# EAGLE design E-Slushy (EAGLE 6.6.0)
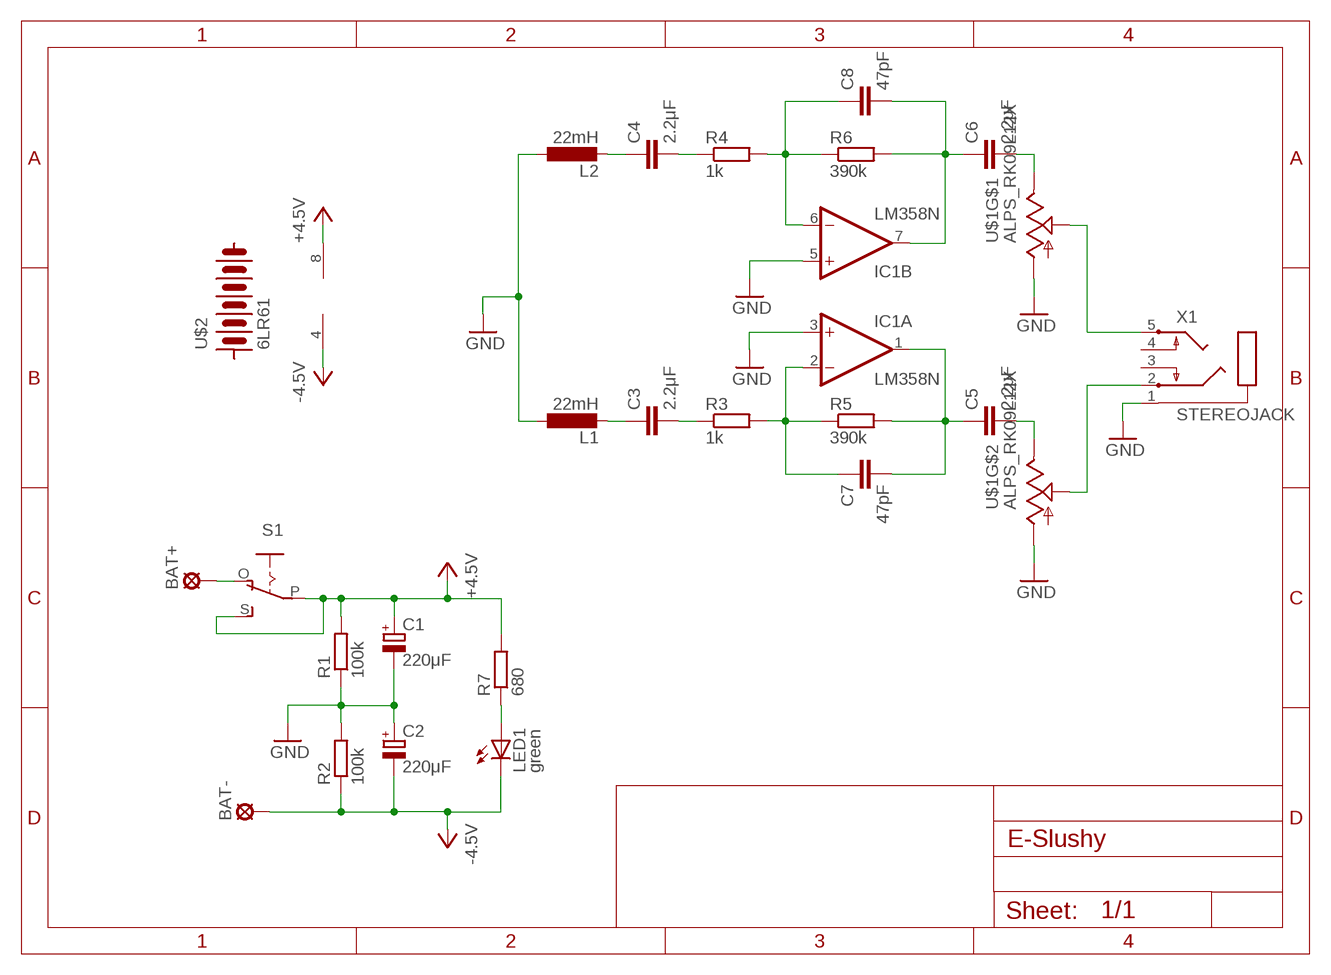
[diagram p0: schematic, sheet 1]

## Parts
BAT+  SE14  [SE14]
BAT-  SE14  [SE14]
C1  220μF  CPOL-EUD  [PANASONIC_D]
C2  220μF  CPOL-EUD  [PANASONIC_D]
C3  2.2μF  C-EUC1206K  [C1206K]
C4  2.2μF  C-EUC1206K  [C1206K]
C5  2.2μF  C-EUC1206K  [C1206K]
C6  2.2μF  C-EUC1206K  [C1206K]
C7  47pF  C-EUC1206K  [C1206K]
C8  47pF  C-EUC1206K  [C1206K]
IC1  LM358N  [DIL08]
L1  22mH  L-EU6000-XXX-RC  [6000-XXXX-RC]
L2  22mH  L-EU6000-XXX-RC  [6000-XXXX-RC]
LED1  green  LED5MM  [LED5MM]
R1  100k  R-EU_R1206  [R1206]
R2  100k  R-EU_R1206  [R1206]
R3  1k  R-EU_R1206  [R1206]
R4  1k  R-EU_R1206  [R1206]
R5  390k  R-EU_R1206  [R1206]
R6  390k  R-EU_R1206  [R1206]
R7  680  R-EU_R1206  [R1206]
S1  EG1218S  [EG1218]
U$1  ALPS_RK09L12X  [RK09L12]
U$2  6LR61  [6LR61]
X1  STEREOJACK  [STX3100]

## Nets
+4.5V: C1.+ IC1.8(P:V+) R1.2 R7.2 S1.P S1.S
-4.5V: BAT-.MP C2.- IC1.4(P:V-) LED1.K(C) R2.1
GND: C1.- C2.+ IC1.3(A:+IN) IC1.5(B:+IN) L1.1 L2.1 R1.1 R2.2 U$1.A1 U$1.B1 X1.1
N$1: C3.1 L1.2
N$2: C3.2 R3.1
N$3: C4.1 L2.2
N$4: C4.2 R4.1
N$5: C7.1 IC1.2(A:-IN) R3.2 R5.1
N$6: C5.1 C7.2 IC1.1(A:OUT) R5.2
N$7: C8.1 IC1.6(B:-IN) R4.2 R6.1
N$8: C6.1 C8.2 IC1.7(B:OUT) R6.2
N$9: C5.2 U$1.B3
N$10: C6.2 U$1.A3
N$11: U$1.B2 X1.2
N$12: U$1.A2 X1.5
N$13: BAT+.MP S1.O
N$14: LED1.A R7.1
Unconnected: X1.3 X1.4

## Library data of the parts
BAT+ BAT- = solpad:SE14: SOLDER PAD E1553, drill 1,4mm, distributor Buerklin, 07F820
C1 C2 = rcl:CPOL-EU: POLARIZED CAPACITOR, European symbol
C3-C8 = rcl:C-EU: CAPACITOR, European symbol
IC1 = linear:LM358: OP AMP also LM158; LM258; LM2904 Source: http://cache.national.com/ds/LM/LM158.pdf
L1 L2 = rcl:L-EU: INDUCTOR, European symbol
LED1 = led:LED: LED OSRAM: - CHIPLED LG R971, LG N971, LY N971, LG Q971, LY Q971, LO R971, LY R971 LH N974, LH R974 LS Q976, LO Q976, LY Q976 LO Q996 - Hyper CHIPLED LW Q18S LB Q993, LB Q99A, LB R99A - SideLED LS A670, LO A670, LY A670, LG A670, LP A670 LB A673, LV A673, LT A673, LW A673 LH A674 LY A675 LS A676, LA A676, LO A676, LY A676, LW A676 LS A679, LY A679, LG A679 - Hyper Micro SIDELED® LS Y876, LA Y876, LO Y876, LY Y876 LT Y87S - SmartLED LW L88C, LW L88S LB L89C, LB L89S, LG L890 LS L89K, LO L89K, LY L89K LS L896, LA L896, LO L896, LY L896 - TOPLED LS T670, LO T670, LY T670, LG T670, LP T670 LSG T670, LSP T670, LSY T670, LOP T670, LYG T670 LG T671, LOG T671, LSG T671 LB T673, LV T673, LT T673, LW T673 LH T674 LS T676, LA T676, LO T676, LY T676, LB T676, LH T676, LSB T676, LW T676 LB T67C, LV T67C, LT T67C, LS T67K, LO T67K, LY T67K, LW E67C LS E67B, LA E67B, LO E67B, LY E67B, LB E67C, LV E67C, LT E67C LW T67C LS T679, LY T679, LG T679 LS T770, LO T770, LY T770, LG T770, LP T770 LB T773, LV T773, LT T773, LW T773 LH T774 LS E675, LA E675, LY E675, LS T675 LS T776, LA T776, LO T776, LY T776, LB T776 LHGB T686 LT T68C, LB T68C - Hyper Mini TOPLED® LB M676 - Mini TOPLED Santana® LG M470 LS M47K, LO M47K, LY M47K Source: http://www.osram.convergy.de LUXEON: - LUMILED® LXK2-PW12-R00, LXK2-PW12-S00, LXK2-PW14-U00, LXK2-PW14-V00 LXK2-PM12-R00, LXK2-PM12-S00, LXK2-PM14-U00 LXK2-PE12-Q00, LXK2-PE12-R00, LXK2-PE12-S00, LXK2-PE14-T00, LXK2-PE14-U00 LXK2-PB12-K00, LXK2-PB12-L00, LXK2-PB12-M00, LXK2-PB14-N00, LXK2-PB14-P00, LXK2-PB14-Q00 LXK2-PR12-L00, LXK2-PR12-M00, LXK2-PR14-Q00, LXK2-PR14-R00 LXK2-PD12-Q00, LXK2-PD12-R00, LXK2-PD12-S00 LXK2-PH12-R00, LXK2-PH12-S00 LXK2-PL12-P00, LXK2-PL12-Q00, LXK2-PL12-R00 Source: www.luxeon.com KINGBRIGHT: KA-3528ASYC Source: www.kingbright.com
R1-R7 = rcl:R-EU_: RESISTOR, European symbol
S1 = adafruit:EG1218: SLIDING SWITCH 0.1" spacing through hole, vertical SPDT slide switch http://www.ladyada.net/library/pcb/eaglelibrary.html
U$1 = audio-pots:ALPS_RK09L12X
U$2 = battery:6LR61
X1 = adafruit:STEREOJACK: MIC/HEADPHONE JACK Stereo jack with two switches. Kycon STX3100, CUI SJ1-3555NG and/or 4UCon 05544

## Board
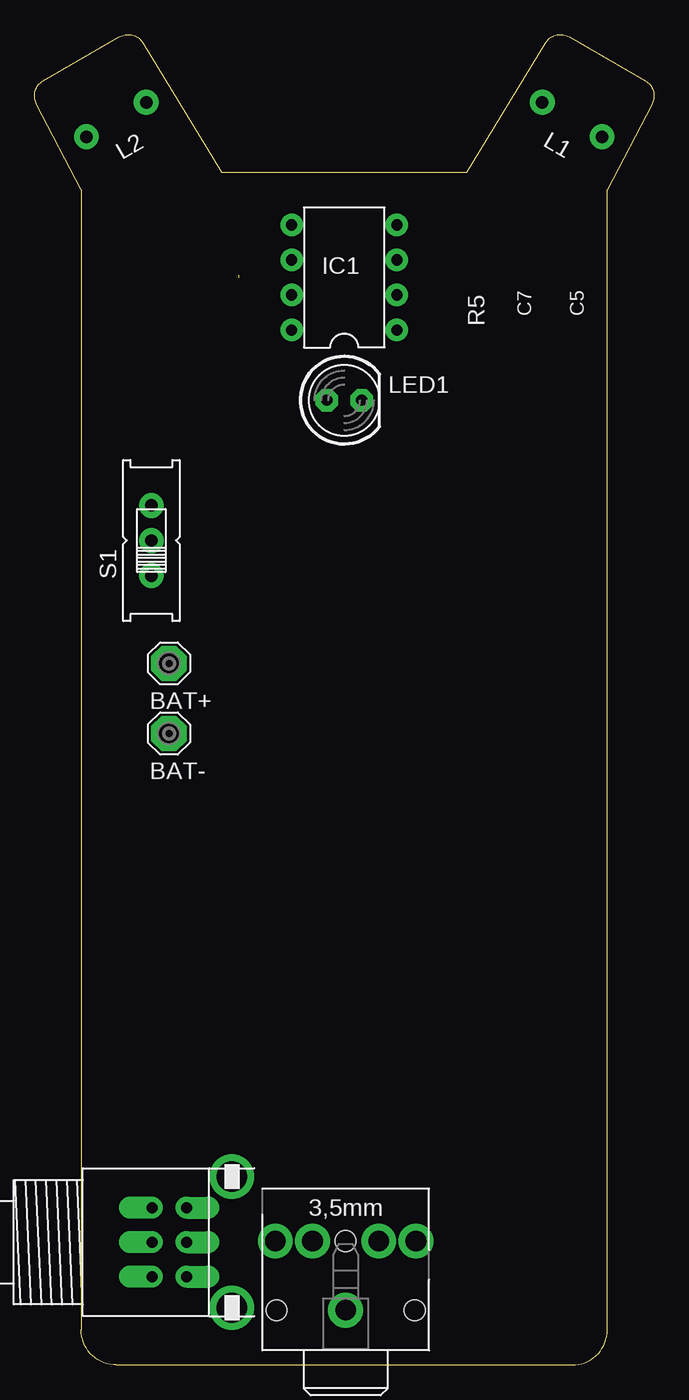
[diagram p1: board, top side]
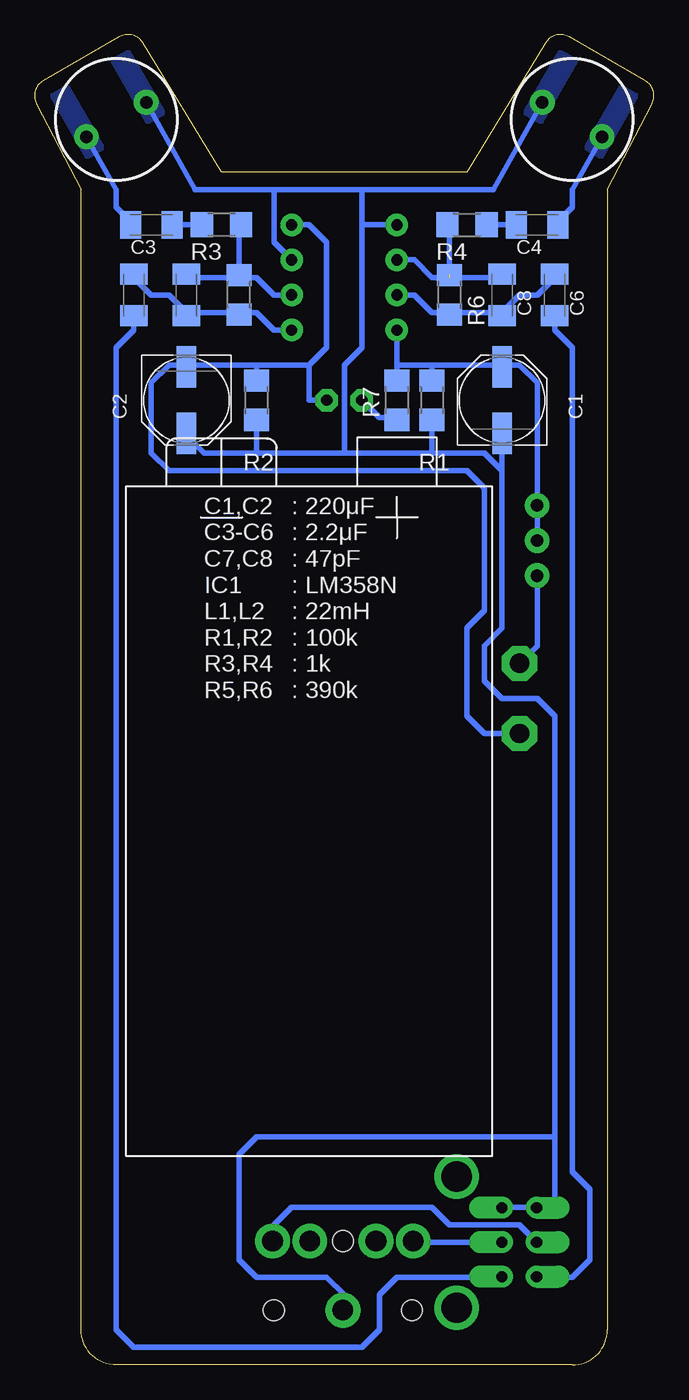
[diagram p2: board, bottom side, seen from below]

Size 44.87 x 96.33 mm. Coordinates in mm from the lower left corner, seen from the top.
Outline: 5.92,0 arc-90 3.38,2.54 3.38,85.09 0.17,91.25 arc-90 0.63,92.98 6.13,96.16 arc-90 7.87,95.69 13.54,86.36 31.32,86.36 37,95.69 arc-90 38.73,96.16 44.23,92.98 arc-90 44.7,91.25 41.48,85.09 41.48,2.54 arc-90 38.94,0 5.92,0
Copper layers (1*16): Top 0.035mm / dielectric 1.5mm / Bottom 0.035mm
Design rules "SeeedStudio_2layer_DRU_no_angle_20140221 *": minimum track width 6mil, minimum drill 12mil, track to track 6mil, track to pad 6mil, pad to pad 6mil, via to via 6mil, smd to smd 0mil, copper to edge 10mil, drill to drill 10mil, minimum pad ring 10mil, minimum via ring 6mil, stop-mask expansion 2mil, vias tented up to drill 100mil, thermal gap 10mil

### Footprints (pad centres in the part's own frame; a part is rotated, then mirrored left to right if it is on the bottom)
SE14 = drill 1.397 pad 2.54 octagon: MP 0,0
PANASONIC_D = smd 3 x 1.4: + 2.4,0; - -2.4,0
C1206K = smd 1.5 x 2: 1 -1.5,0; 2 1.5,0
DIL08 = drill 0.813 pad 1.27: 1 -3.81,-3.81; 2 -1.27,-3.81; 3 1.27,-3.81; 4 3.81,-3.81; 5 3.81,3.81; 6 1.27,3.81; 7 -1.27,3.81; 8 -3.81,3.81
6000-XXXX-RC = drill 0.9 pad 1.422: 1 -2.5,0; 2 2.5,0
LED5MM = drill 0.813 octagon: A -1.27,0; K 1.27,0
R1206 = smd 1.6 x 1.803: 1 -1.422,0; 2 1.422,0
EG1218 = drill 0.9 pad 1.676: O -2.54,0; P 0,0; S 2.54,0
RK09L12 = drill 0.8 offset: A1 2.5,2.5; A2 0,2.5; A3 -2.5,2.5; B1 2.5,0; B2 0,0; B3 -2.5,0 | drill 2.2 pad 3: P$1 -4.75,-3.3; P$2 4.75,-3.3
STX3100 = drill 1.5 pad 2.54: 1 2.7,-0.1 | drill 1.5: 2 7.7,5; 3 7.7,2.3; 4 7.7,-2.5; 5 7.7,-5.2 | hole 1.5: 2.7,4.9; 2.7,-5.1; 7.7,-0.1

### Placement (x,y rotation side)
BAT+  9.73,50.8 0 top
BAT-  9.73,45.72 0 top
C1  11,69.85 90 bottom
C2  33.86,69.85 270 bottom
C3  36.4,82.55 0 bottom
C4  8.46,82.55 180 bottom
C5  37.67,77.47 270 bottom
C6  7.19,77.47 270 bottom
C7  33.86,77.47 270 bottom
C8  11,77.47 270 bottom
IC1  22.43,78.74 90 top
L1  38.94,90.17 210 bottom
L2  5.92,90.17 330 bottom
LED1  22.43,69.85 0 top
R1  16.08,69.85 90 bottom
R2  28.78,69.85 270 bottom
R3  31.32,82.55 0 bottom
R4  13.54,82.55 180 bottom
R5  30.05,77.47 270 bottom
R6  14.81,77.47 270 bottom
R7  18.62,69.85 90 bottom
S1  8.46,59.69 90 top
U$1  11,8.89 90 top
U$2  24.97,39.37 0 bottom
X1  22.43,1.27 90 top

### Tracks (layer width: path | path; a pad name or v marks a point on that pad's centre or on a via)
+4.5V
  Bottom 0.406: R1.2 16.08,72.39 | 16.08,72.39 18.62,72.39 | 18.62,72.39 IC1.8 | 11,72.39 16.08,72.39 | S1.P S1.S 8.46,68.58 8.46,71.12 9.73,72.39 11,72.39 | C1.+ 11,72.39 | R7.2 18.62,72.39
-4.5V
  Bottom 0.406: 24.97,72.39 23.7,73.66 23.7,81.28 24.97,82.55 IC1.4 | BAT-.MP 12.27,45.72 13.54,46.99 13.54,53.34 12.27,54.61 12.27,63.5 13.54,64.77 35.13,64.77 36.4,66.04 36.4,71.12 35.13,72.39 33.86,72.39 | R2.1 28.78,72.39 | 28.78,72.39 24.97,72.39 | 33.86,72.39 28.78,72.39 | C2.- 33.86,72.39 | LED1.K 24.97,69.85 24.97,72.39
GND
  Bottom 0.406: 21.16,85.09 27.51,85.09 | IC1.3 27.51,81.28 27.51,85.09 | 21.16,82.55 21.16,73.66 22.43,72.39 22.43,66.04 | 21.16,82.55 21.16,85.09 | IC1.5 21.16,82.55 | 22.43,66.04 28.78,66.04 | 28.78,66.04 32.59,66.04 33.86,67.31 C2.+ | 16.08,66.04 12.27,66.04 11,64.77 | 16.08,66.04 22.43,66.04 | C1.- 11,64.77 | 11,64.77 11,53.34 12.27,52.07 12.27,49.53 11,48.26 8.46,48.26 7.19,46.99 7.19,16.51 | 7.19,16.51 7.19,11.43 8.46,11.43 | U$1.A1 8.46,11.43 | 8.46,11.43 10.96,11.43 U$1.B1 | X1.1 22.53,3.91 22.43,3.81 22.43,5.08 23.7,6.35 28.78,6.35 30.05,7.62 30.05,15.24 28.78,16.51 7.19,16.51 | L1.1 33.23,85.09 27.51,85.09 | L2.1 11.64,85.09 21.16,85.09 | R1.1 16.08,66.04 | R2.2 28.78,66.04
  pour Bottom (no thermals): 9.31,90.66 8.21,90.02 5.67,94.42 6.77,95.06
  pour Bottom (no thermals): 36.66,90.02 35.56,90.66 38.1,95.06 39.2,94.42
N$1
  Bottom 0.406: L1.2 38.94,85.09 38.94,83.82 37.67,82.55 C3.1
  pour Bottom (no thermals): 41.06,87.48 39.96,88.12 42.5,92.52 43.6,91.88
N$2
  Bottom 0.406: R3.1 C3.2
N$3
  Bottom 0.406: L2.2 5.92,85.09 5.92,83.82 7.19,82.55 C4.1
  pour Bottom (no thermals): 4.91,88.12 3.81,87.48 1.27,91.88 2.37,92.52
N$4
  Bottom 0.406: C4.2 R4.1
N$5
  Bottom 0.406: IC1.2 27.51,77.47 28.78,78.74 30.05,78.74 | 30.05,78.74 R5.1 30.05,82.55 R3.2 | 30.05,78.74 33.86,78.74 C7.1
N$6
  Bottom 0.406: IC1.1 27.51,74.93 28.78,76.2 30.05,76.2 | 30.05,76.2 R5.2 | 33.86,76.2 30.05,76.2 | C5.1 37.67,78.74 36.4,77.47 35.13,77.47 33.86,76.2 | 33.86,76.2 C7.2
N$7  (1 unrouted)
  Bottom 0.406: R4.2 14.81,82.55 14.81,78.74 | C8.1 11,78.74 14.81,78.74 | IC1.6 17.35,80.01 16.08,78.74 14.81,78.74
N$8
  Bottom 0.406: 14.81,76.2 11,76.2 | C8.2 11,76.2 | 11,76.2 9.73,77.47 8.46,77.47 7.19,78.74 C6.1 | R6.2 14.81,76.2 | 14.81,76.2 16.08,76.2 17.35,77.47 IC1.7
N$9
  Bottom 0.406: C5.2 37.67,74.93 38.94,73.66 38.94,2.54 37.67,1.27 21.16,1.27 19.89,2.54 19.89,5.08 18.62,6.35 11,6.35 U$1.B3
N$10
  Bottom 0.406: U$1.A3 8.46,6.35 5.92,6.35 4.65,7.62 4.65,12.7 5.92,13.97 5.92,73.66 7.19,74.93 C6.2
N$11
  Bottom 0.406: X1.2 17.35,8.89 U$1.B2
N$12
  Bottom 0.406: U$1.A2 8.5,8.93 9.73,10.16 14.81,10.16 16.08,11.43 26.24,11.43 27.51,10.16 27.51,8.89 27.59,8.97 X1.5
N$13
  Bottom 0.406: BAT+.MP 8.46,52.07 S1.O
N$14
  Bottom 0.406: R7.1 18.62,68.58 19.89,68.58 LED1.A

### Text on the board
bNames: : 220μF / : 2.2μF / : 47pF / : LM358N / : 22mH / : 100k / : 1k / : 390k | C1,C2 / C3-C6 / C7,C8 / IC1 / L1,L2 / R1,R2 / R3,R4 / R5,R6